# EasyEDA Pro project ProPrj_EEG_2025-12-13.epro

# Schematic fonte
Board Name: Fonte; Create Date: 2025-09-29; Page Name: P1; Project Name: EEG; Schematic Name: fonte; Update Date: 2025-10-28; Company: EasyEDA.com; Page Size: A4; Version: V1.0
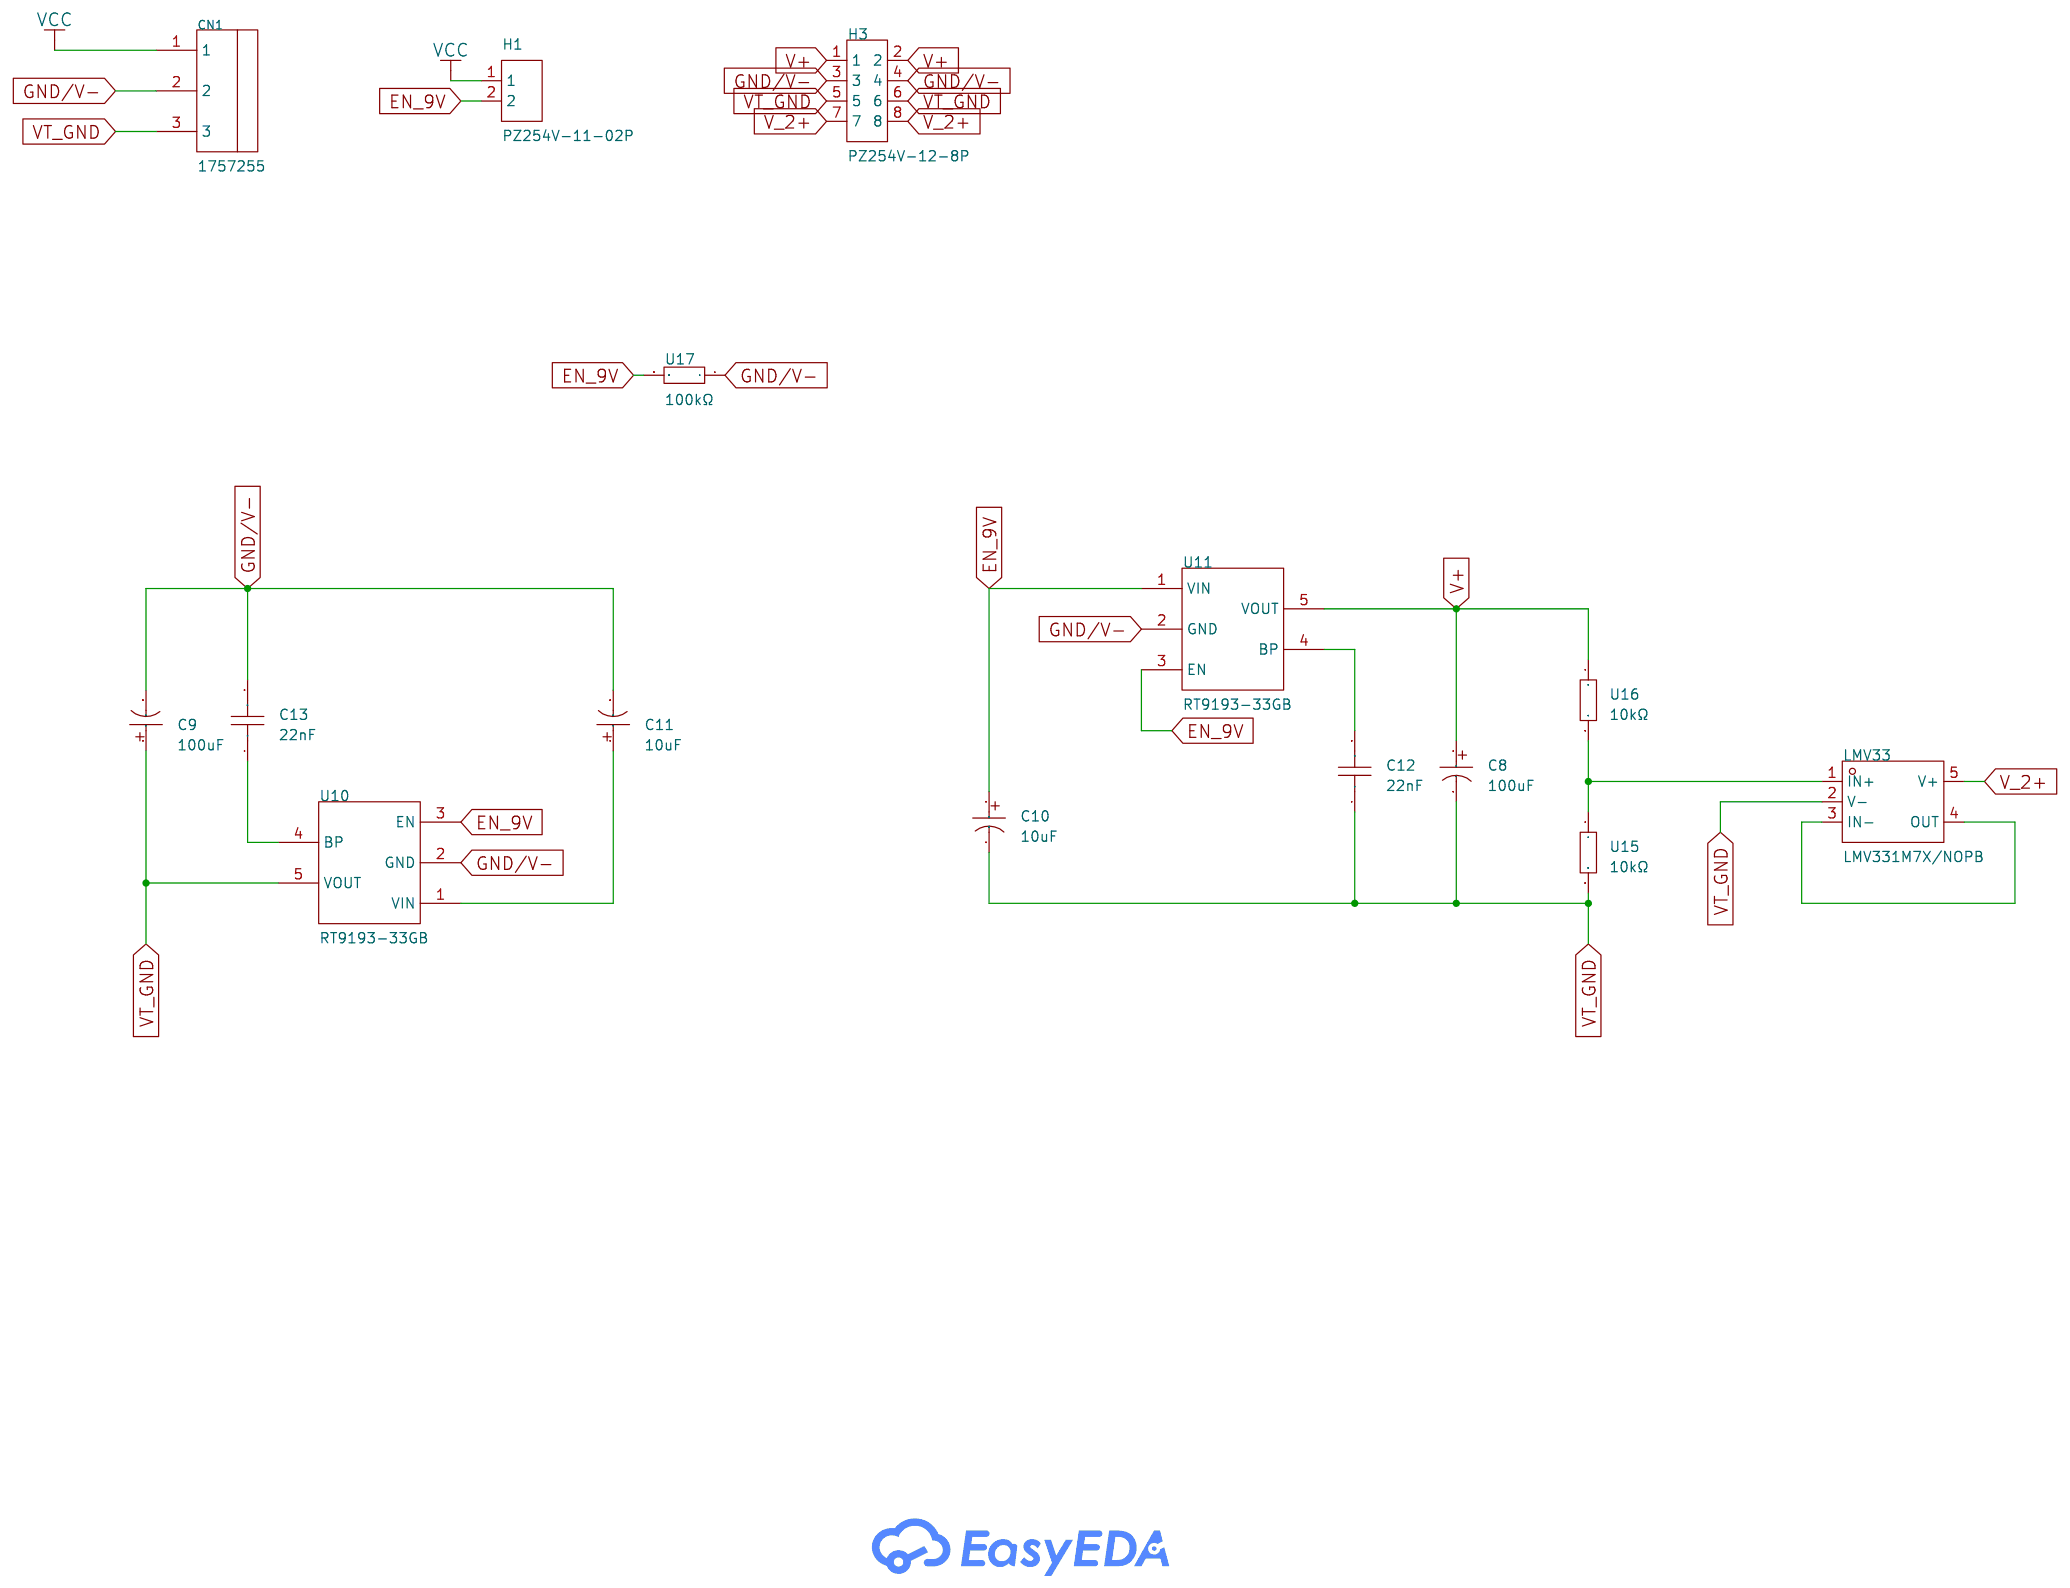
[diagram p0: schematic sheet]

## Parts
C8  100uF  [CAP-TH_BD5.0-P2.00-D0.8-FD]
C9  100uF  [CAP-TH_BD5.0-P2.00-D0.8-FD]
C10  10uF  [CAP-TH_BD5.0-P2.00-D0.8-FD]
C11  10uF  [CAP-TH_BD5.0-P2.00-D0.8-FD]
C12  22nF  [CAP-TH_L4.8-W2.3-P5.08-D0.65]
C13  22nF  [CAP-TH_L4.8-W2.3-P5.08-D0.65]
CN1  1757255  [CONN-TH_3P-P5.08_1757255]
H1  PZ254V-11-02P  [HDR-TH_2P-P2.54-V-M]
H3  PZ254V-12-8P  [HDR-TH_8P-P2.54-V-M-R2-C4-S2.54]
LMV33  LMV331M7X/NOPB  [SC-70-5_L2.1-W1.3-P0.65-LS2.1-BR]
U10  RT9193-33GB  [SOT-23-5_L3.0-W1.7-P0.95-LS2.8-BL]
U11  RT9193-33GB  [SOT-23-5_L3.0-W1.7-P0.95-LS2.8-BL]
U15  10kΩ  [RES-TH_BD2.7-L6.2-P10.20-D0.4]
U16  10kΩ  [RES-TH_BD2.7-L6.2-P10.20-D0.4]
U17  100kΩ  [RES-TH_BD2.7-L6.2-P10.20-D0.4]

## Library data of the parts
C8 C9 = KS107M016D07RR0VH2FP0: Capacitance:100uF Tolerance:±20% Tolerance:±20% Voltage Rating:16V Ripple Current:- Equivalent Series Resistance(ESR):- Pin Spacing:2mm Diameter:5mm Height - Seated (Max):7mm Lifetime:1000hrs@105℃ Operating Temperature:-40℃~+105℃ Operating Temperature:-40; LCSC Part Name: 100uF ±20% 16V; Supplier Part: C43803; Manufacturer: Chengx(承兴); Supplier Footprint: 插件,D5xL7mm; JLCPCB Part Class: Extended Part; Datasheet: https://item.szlcsc.com/datasheet/KS107M016D07RR0VH2FP0/44805.html; Supplier: LCSC; Tolerance: ±20%; Voltage Rating: 16V; Pin Spacing: 2mm; Diameter: 5mm; Height - Seated (Max): 7mm; Lifetime: 1000hrs@105℃; Operating Temperature: -40℃~+105℃
C10 C11 = KM106M016D11RR0VH2FP0: Capacitance:10uF Tolerance:±20% Tolerance:±20% Voltage Rating:16V Ripple Current:35mA@120Hz Equivalent Series Resistance(ESR):- Pin Spacing:2mm Diameter:5mm Height - Seated (Max):11mm Lifetime:1000hrs@105℃; LCSC Part Name: 10uF ±20% 16V; Supplier Part: C43799; Manufacturer: Chengx(承兴); Supplier Footprint: 插件,D5xL11mm; JLCPCB Part Class: Extended Part; Datasheet: https://item.szlcsc.com/datasheet/KM106M016D11RR0VH2FP0/44801.html; Supplier: LCSC; Tolerance: ±20%; Voltage Rating: 16V; Ripple Current: 35mA@120Hz; Pin Spacing: 2mm; Diameter: 5mm; Height - Seated (Max): 11mm; Lifetime: 1000hrs@105℃
C12 C13 = CC1H223ZC1FD3F4D1000: Capacitance:22nF Tolerance:-20%~+80% Tolerance:-20%~+80% Voltage Rating:50V Pin Spacing:5.08mm Temperature Coefficient:Y5V Diameter:4.8mm Body Thickness:2.2mm; LCSC Part Name: 22nF -20%~+80% 50V; Supplier Part: C377845; Manufacturer: Dersonic(德尔创); Supplier Footprint: 插件,P=5.08mm; JLCPCB Part Class: Extended Part; Datasheet: https://item.szlcsc.com/datasheet/CC1H223ZC1FD3F4D1000/350340.html; Supplier: LCSC; Tolerance: -20%~+80%; Voltage Rating: 50V; Pin Spacing: 5.08mm; Temperature Coefficient: Y5V; Diameter: 4.8mm; Body Thickness: 2.2mm
CN1 = 1757255: Connector Type:Board Side/Socket - Closed Number of Positions or Pins:1x3P Pitch:5.08mm Color:Green Mounting Type:Right-Angle Pin Number of Pins:3P Number of Rows:1 Number of PINs Per Row:3; LCSC Part Name: 5.08mm 1x3P 排数:1 每排P数:3; Supplier Part: C92141; Manufacturer: Phoenix Contact(菲尼克斯); Supplier Footprint: 弯插,P=5.08mm; JLCPCB Part Class: Extended Part; Datasheet: https://item.szlcsc.com/datasheet/1757255/93331.html; Supplier: LCSC; Connector Type: Board Side/Socket - Closed; Number of Positions or Pins: 1x3P; Pitch: 5.08mm; Color: Green; Mounting Type: Right-Angle Pin; Number of Pins: 3P; Number of Rows: 1; Number of PINs Per Row: 3
H1 = PZ254V-11-02P: Pin Structure:1x2P Pitch:2.54mm Row Spacing:- Circluar Pins/Square Pins:Pin Header Mounting Type:Through Hole Number of Rows:1 Number of Pins:2P Current Rating:- Voltage Rating (Max):- Length of Mating Pin:6mm Insulation Height:2.5mm Length of End Connect; LCSC Part Name: 1x2P 间距:2.54mm 方针 直插; Supplier Part: C492401; Manufacturer: XFCN(兴飞); Supplier Footprint: 插件,P=2.54mm; JLCPCB Part Class: Extended Part; Datasheet: https://item.szlcsc.com/datasheet/PZ254V-11-02P/502957.html; Supplier: LCSC; Pin Structure: 1x2P; Pitch: 2.54mm; Circluar Pins/Square Pins: Pin Header; Mounting Type: Through Hole; Number of Rows: 1; Number of Pins: 2P; Length of Mating Pin: 6mm; Insulation Height: 2.5mm; Length of End Connection Pin: 3mm; Contact Material: Brass; Operating Temperature: -40℃~+105℃; Color: Black
H3 = PZ254V-12-8P: Pin Structure:2x4P Pitch:2.54mm Row Spacing:2.54mm Circluar Pins/Square Pins:Pin Header Mounting Type:Through Hole Number of Rows:2 Number of Pins:8P Current Rating:- Voltage Rating (Max):- Length of Mating Pin:6mm Insulation Height:2.5mm Length of End Co; LCSC Part Name: 2x4P 间距:2.54mm 方针 直插; Supplier Part: C492421; Manufacturer: XFCN(兴飞); Supplier Footprint: 插件,P=2.54mm; JLCPCB Part Class: Extended Part; Datasheet: https://item.szlcsc.com/datasheet/PZ254V-12-8P/502977.html; Supplier: LCSC; Pin Structure: 2x4P; Pitch: 2.54mm; Row Spacing: 2.54mm; Circluar Pins/Square Pins: Pin Header; Mounting Type: Through Hole; Number of Rows: 2; Number of Pins: 8P; Length of Mating Pin: 6mm; Insulation Height: 2.5mm; Length of End Connection Pin: 3mm; Contact Material: Brass; Operating Temperature: -40℃~+105℃; Color: Black
LMV33 = LMV331M7X/NOPB: Number of Channels:1 Vos - Input Offset Voltage:7mV Ib - Input Bias Current:250nA Propagation Delay Time:600ns Input Hysteresis Voltage (Vhys):- Common Mode Rejection Ratio(CMRR):- Output Type:- Output Type:TTL；CMOS Rail to Rail:Rail-to-Rail Input Quiesce; Supplier Part: C701938; Manufacturer: TI(德州仪器); Supplier Footprint: SC-70-5; JLCPCB Part Class: Extended Part; Datasheet: https://www.ti.com/cn/lit/gpn/lmv393-n; Supplier: LCSC; Number of Channels: 1; Vos - Input Offset Voltage: 7mV; Ib - Input Bias Current: 250nA; Propagation Delay Time: 600ns; Output Type: TTL；CMOS; Rail to Rail: Rail-to-Rail Input; Quiescent Current: 140uA; Operating Temperature: -40℃~+85℃
U10 U11 = RT9193-33GB: Output Type:Fixed Voltage - Supply:5.5V Output Voltage:3.3V Output Voltage:3.3V Output Current:300mA Power Supply Rejection Ratio (PSRR):-50dB@(10kHz) Voltage Dropout:220mV@(300mA) standby current:90uA Noise:100uVrms Features:Over Current Protection；Enabl; LCSC Part Name: 输入5.5V 输出3.3V 300mA; Supplier Part: C15651; Manufacturer: RICHTEK(立锜); Supplier Footprint: SOT-23-5; JLCPCB Part Class: Extended Part; Datasheet: https://item.szlcsc.com/datasheet/RT9193-33GB/16332.html; Supplier: LCSC; Output Type: Fixed; Voltage - Supply: 5.5V; Output Voltage: 3.3V; Output Current: 300mA; Power Supply Rejection Ratio (PSRR): -50dB@(10kHz); Voltage Dropout: 220mV@(300mA); standby current: 90uA; Noise: 100uVrms; Features: Over Current Protection；Enable；Over Temperature Protection; Operating Temperature: -40℃~+125℃@(Tj); Output Configuration: Positive; Number of Outputs: 1
U15-U17 = MF1/4W-100K±1%-OT26: Type:Metal Film Resistors Resistance: Tolerance:±1% Tolerance:±1% Overload Voltage (Max):250V Power(Watts):250mW Temperature Coefficient:±350ppm/℃ Temperature Coefficient:±350ppm/℃ Operating Temperature Range:-55℃~+155℃ Operating Temperature Range:-55℃~+1; LCSC Part Name: 金属膜电阻 100kΩ ±1% 250mW; Supplier Part: C2843019; Manufacturer: VO(翔胜); Supplier Footprint: 插件,D2.7xL6.2mm; JLCPCB Part Class: Extended Part; Datasheet: https://atta.szlcsc.com/upload/public/pdf/source/20200609/C601728_5AA4C0C8E12E11069DA2C3356F29D1F2.pdf; Supplier: LCSC; Type: Metal Film Resistors; Tolerance: ±1%; Overload Voltage (Max): 250V; Power(Watts): 250mW; Temperature Coefficient: ±350ppm/℃; Operating Temperature Range: -55℃~+155℃

## Nets
VCC: CN1.1 H1.1
EN_9V: C10.1 H1.2 U10.3(EN) U11.1(VIN) U11.3(EN) U17.2
GND/V-: C9.2 C11.2 C13.2 CN1.2 H3.3 H3.4 U10.2(GND) U11.2(GND) U17.1
V+: C8.1 H3.1 H3.2 U11.5(VOUT) U16.1
V_2+: H3.7 H3.8 LMV33.5(V+)
VT_GND: C8.2 C9.1 C10.2 C12.1 CN1.3 H3.5 H3.6 LMV33.2(V-) U10.5(VOUT) U15.2
$1N1779: LMV33.3(IN-) LMV33.4(OUT)
Net-(C11-1): C11.1 U10.1(VIN)
Net-(C12-2): C12.2 U11.4(BP)
Net-(C13-1): C13.1 U10.4(BP)
Net-(LMV33-1): LMV33.1(IN+) U15.1 U16.2

# Schematic canal
Board Name: Canal; Create Date: 2025-09-29; Page Name: P1; Project Name: EEG; Schematic Name: canal; Update Date: 2025-11-23; Company: EasyEDA.com; Page Size: A4; Version: V1.0
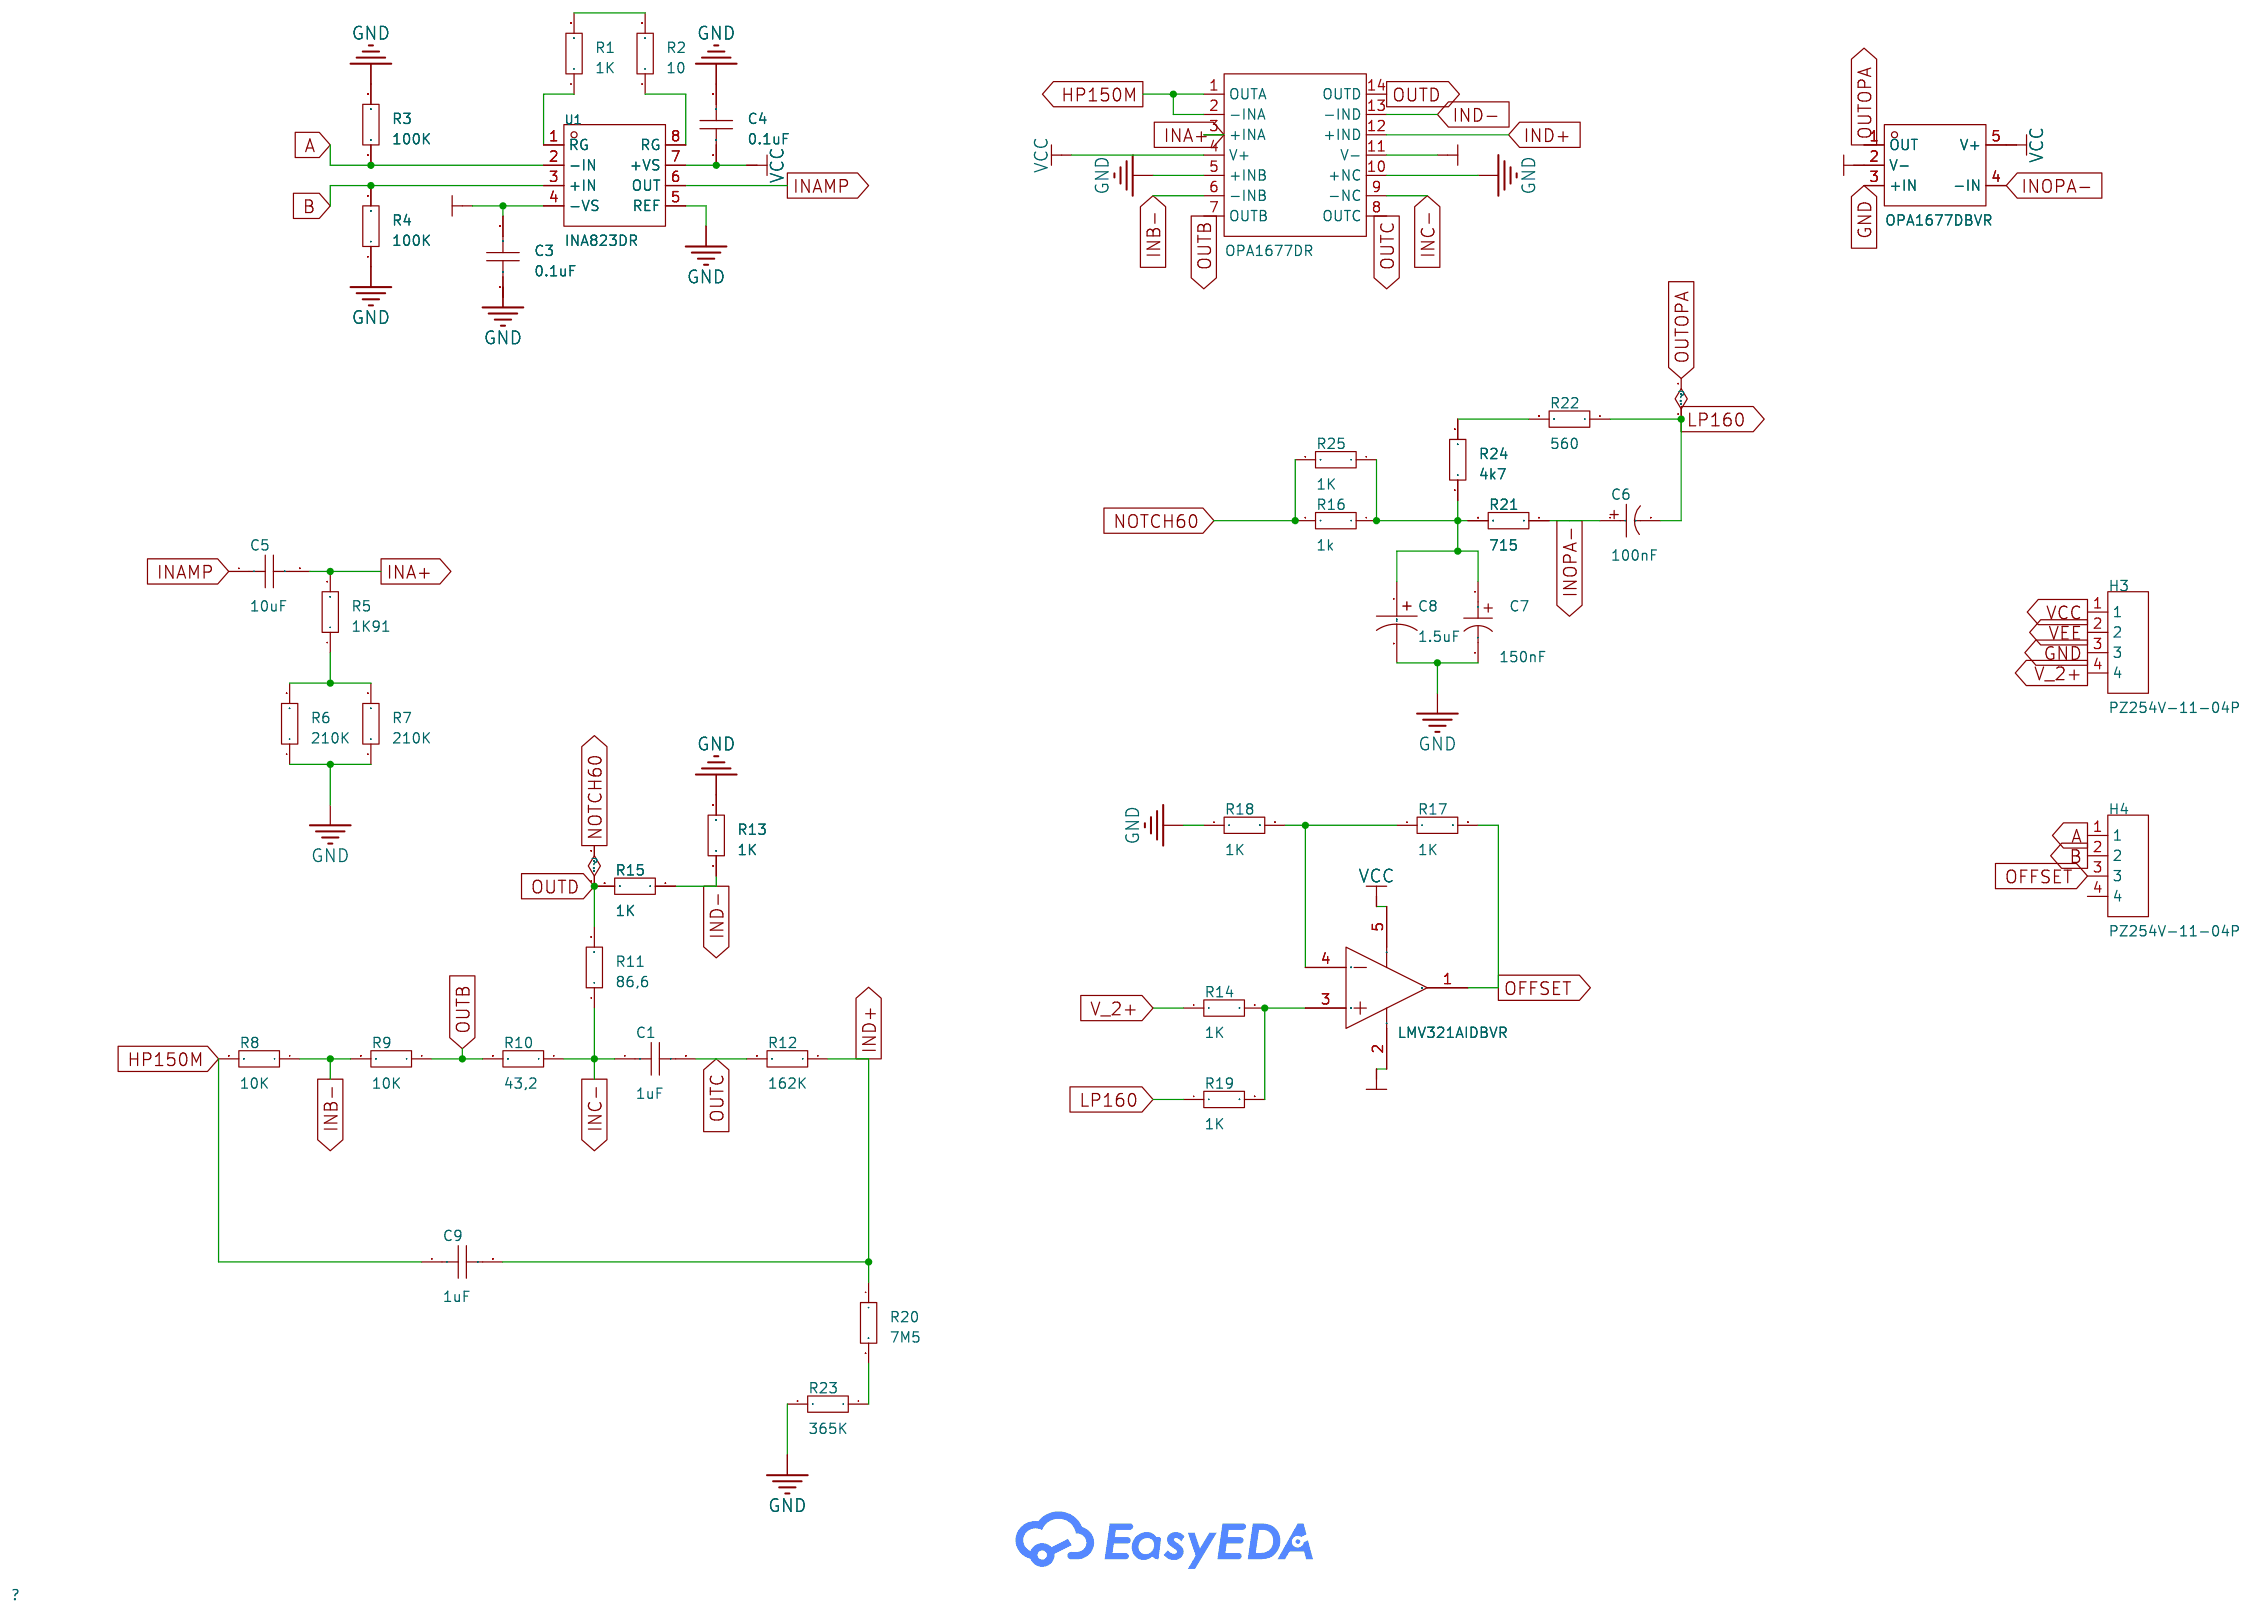
[diagram p1: schematic sheet]

## Parts
C1  1uF  [CAP-TH_L7.5-W5.0-P5.00-D1.0]
C3  0.1uF  [CAP-TH_L7.5-W5.0-P5.00-D1.0]
C4  0.1uF  [CAP-TH_L7.5-W5.0-P5.00-D1.0]
C5  10uF  [CAP-TH_L5.0-W2.5-P2.50-D0.5]
C6  100nF  [CAP-TH_BD4.0-P1.50-D0.8-FD]
C7  150nF  [CAP-TH_BD4.0-P1.50-D0.5-FD]
C8  1.5uF  [CAP-TH_BD8.0-P3.50-D0.6-FD]
C9  1uF  [CAP-TH_L7.5-W5.0-P5.00-D1.0]
H3  PZ254V-11-04P  [HDR-TH_4P-P2.54-V-M]
H4  PZ254V-11-04P  [HDR-TH_4P-P2.54-V-M]
R1  1K  [RES-TH_BD3.8-L8.5-P15.00-D0.6]
R2  10  [RES-TH_BD3.8-L8.5-P15.00-D0.6]
R3  100K  [RES-TH_BD3.8-L8.5-P15.00-D0.6]
R4  100K  [RES-TH_BD3.8-L8.5-P15.00-D0.6]
R5  1K91  [RES-TH_BD3.8-L8.5-P15.00-D0.6]
R6  210K  [RES-TH_BD3.8-L8.5-P15.00-D0.6]
R7  210K  [RES-TH_BD3.8-L8.5-P15.00-D0.6]
R8  10K  [RES-TH_BD3.8-L8.5-P15.00-D0.6]
R9  10K  [RES-TH_BD3.8-L8.5-P15.00-D0.6]
R10  43,2  [RES-TH_BD3.8-L8.5-P15.00-D0.6]
R11  86,6  [RES-TH_BD3.8-L8.5-P15.00-D0.6]
R12  162K  [RES-TH_BD3.8-L8.5-P15.00-D0.6]
R13  1K  [RES-TH_BD3.8-L8.5-P15.00-D0.6]
R14  1K  [RES-TH_BD3.8-L8.5-P15.00-D0.6]
R15  1K  [RES-TH_BD3.8-L8.5-P15.00-D0.6]
R16  1k  [RES-TH_BD3.8-L8.5-P15.00-D0.6]
R17  1K  [RES-TH_BD3.8-L8.5-P15.00-D0.6]
R18  1K  [RES-TH_BD3.8-L8.5-P15.00-D0.6]
R19  1K  [RES-TH_BD3.8-L8.5-P15.00-D0.6]
R20  7M5  [RES-TH_BD3.8-L8.5-P15.00-D0.6]
R21  715  [RES-TH_BD3.8-L8.5-P15.00-D0.6]
R22  560  [RES-TH_BD3.8-L8.5-P15.00-D0.6]
R23  365K  [RES-TH_BD3.8-L8.5-P15.00-D0.6]
R24  4k7  [RES-TH_BD3.8-L8.5-P15.00-D0.6]
R25  1K  [RES-TH_BD3.8-L8.5-P15.00-D0.6]
U1  INA823DR  [SOIC-8_L4.9-W3.9-P1.27-LS6.0-BL]
U2  OPA1677DR  [SOIC-14_L8.7-W3.9-P1.27-LS6.0-BL]
U3  OPA1677DBVR  [SOT-23-5_L2.9-W1.6-P0.95-LS2.8-BR]
U4  LMV321AIDBVR  [SOT-23-5_L2.9-W1.6-P0.95-LS2.8-TL]

## Library data of the parts
C1 C3 C4 C9 = CC45SL3DD101JYVNA: Capacitance:100pF Tolerance:±5% Tolerance:±5% Voltage Rating:2kV Pin Spacing:5mm Temperature Coefficient:SL Diameter:7.5mm Body Thickness:5mm; LCSC Part Name: 100pF ±5% 2kV; Supplier Part: C342459; Manufacturer: TDK; Supplier Footprint: 插件,P=5mm; JLCPCB Part Class: Extended Part; Datasheet: https://item.szlcsc.com/datasheet/CC45SL3DD101JYVNA/319309.html; Supplier: LCSC; Tolerance: ±5%; Voltage Rating: 2kV; Pin Spacing: 5mm; Temperature Coefficient: SL; Diameter: 7.5mm; Body Thickness: 5mm
C5 = CC1H103ZA1ED3F4D1100: Capacitance:10nF Tolerance:-20%~+80% Tolerance:-20%~+80% Voltage Rating:50V Pin Spacing:2.54mm Temperature Coefficient:Y5V Diameter:5mm Body Thickness:2.4mm; LCSC Part Name: 10nF -20%~+80% 50V; Supplier Part: C2832505; Manufacturer: Dersonic(德尔创); Supplier Footprint: 插件,P=2.54mm; JLCPCB Part Class: Extended Part; Datasheet: https://item.szlcsc.com/datasheet/CC1H103ZA1ED3F4D1100/2990643.html; Supplier: LCSC; Tolerance: -20%~+80%; Voltage Rating: 50V; Pin Spacing: 2.54mm; Temperature Coefficient: Y5V; Diameter: 5mm; Body Thickness: 2.4mm
C6 = KS104M050C07RR0VH2FP0: Capacitance:100nF Tolerance:±20% Tolerance:±20% Voltage Rating:50V Ripple Current:1A@100kHz Equivalent Series Resistance(ESR):- Pin Spacing:1.5mm Diameter:4mm Height - Seated (Max):7mm Lifetime:1000hrs@105℃ Operating Temperature:-40℃~+105℃ Operating Tempe; LCSC Part Name: 100nF ±20% 50V; Supplier Part: C45664; Manufacturer: Chengx(承兴); Supplier Footprint: 插件,D4xL7mm; JLCPCB Part Class: Extended Part; Datasheet: https://item.szlcsc.com/datasheet/KS104M050C07RR0VH2FP0/46666.html; Supplier: LCSC; Tolerance: ±20%; Voltage Rating: 50V; Ripple Current: 1A@100kHz; Pin Spacing: 1.5mm; Diameter: 4mm; Height - Seated (Max): 7mm; Lifetime: 1000hrs@105℃; Operating Temperature: -40℃~+105℃
C7 = EEA-GA1HR15: Capacitance:150nF Tolerance:±20% Tolerance:±20% Rated Voltage: Ripple Current:1.7mA@120Hz Equivalent Series Resistance(ESR):- Lead Spacing: φD: L: Lifetime @ Temp:1000hrs@105℃ Operating Temperature:-55℃~+105℃ Operating Temperature:-55℃~+105℃; LCSC Part Name: 150nF ±20% 50V; Supplier Part: C5114215; Manufacturer: PANASONIC(松下); Supplier Footprint: 插件,D4xL7mm; JLCPCB Part Class: Extended Part; Datasheet: https://atta.szlcsc.com/upload/public/pdf/source/20231023/GA_Series_Type_A.pdf-271ac9210b5e00e392f99268b7a37256.pdf; Supplier: LCSC; Tolerance: ±20%; Ripple Current: 1.7mA@120Hz; Lifetime @ Temp: 1000hrs@105℃; Operating Temperature: -55℃~+105℃
C8 = ECG2GM1R5F12OTBO: Capacitance:1.5uF Tolerance:±20% Tolerance:±20% Voltage Rating:400V Ripple Current:73mA@100kHz Equivalent Series Resistance(ESR):- Pin Spacing:3.5mm Diameter:8mm Height - Seated (Max):12mm Lifetime:8000hrs@105℃; LCSC Part Name: 1.5uF ±20% 400V; Supplier Part: C711612; Manufacturer: Yunxing(云星); Supplier Footprint: 插件,D8xL12mm; JLCPCB Part Class: Extended Part; Datasheet: https://item.szlcsc.com/datasheet/ECG2GM1R5F12OTBO/750717.html; Supplier: LCSC; Tolerance: ±20%; Voltage Rating: 400V; Ripple Current: 73mA@100kHz; Pin Spacing: 3.5mm; Diameter: 8mm; Height - Seated (Max): 12mm; Lifetime: 8000hrs@105℃
H3 H4 = PZ254V-11-04P_C492403: Pin Structure:1x4P Pitch:2.54mm Row Spacing:- Circluar Pins/Square Pins:Policy Mounting Type:Straight Number of Rows:Single Row Number of Pins:4P Current Rating:- Voltage Rating (Max):- Length of Mating Pin:6mm Insulation Height:2.5mm Length of End Connec; LCSC Part Name: 1x4P 间距:2.54mm 方针 直插; Supplier Part: C492403; Manufacturer: XFCN(兴飞); Supplier Footprint: 插件,P=2.54mm; JLCPCB Part Class: Extended Part; Datasheet: https://atta.szlcsc.com/upload/public/pdf/source/20200309/C492403_F9F19131791D08044AD4F84F8E751A34.pdf; Supplier: LCSC; Pin Structure: 1x4P; Pitch: 2.54mm; Circluar Pins/Square Pins: Policy; Mounting Type: Straight; Number of Rows: Single Row; Number of Pins: 4P; Length of Mating Pin: 6mm; Insulation Height: 2.5mm; Length of End Connection Pin: 3mm; Contact Material: Brass; Operating Temperature: -40℃~+105℃; Color: Black
R1-R25 = Res_0603: Supplier Footprint: 0603
U1 = INA823DR: Number of Channels:1 Ib - Input Bias Current:1.2pA Vos - Input Offset Voltage:20uV Gain Bandwidth Product:- Slew Rate:1V/us Operating Temperature:-40℃~+125℃ Operating Temperature:-40℃~+125℃; LCSC Part Name: 精密(100uV)、低功耗(250uA)、宽电源(2.7V 至 36V）仪表放大器; Supplier Part: C5213939; Manufacturer: TI(德州仪器); Supplier Footprint: SOIC-8; JLCPCB Part Class: Extended Part; Datasheet: https://www.ti.com/cn/lit/gpn/ina823; Supplier: LCSC; Number of Channels: 1; Ib - Input Bias Current: 1.2pA; Vos - Input Offset Voltage: 20uV; Slew Rate: 1V/us; Operating Temperature: -40℃~+125℃
U2 = OPA1677DR: Supplier Part: C22444684; Manufacturer: TI(德州仪器); Supplier Footprint: SOIC-8; JLCPCB Part Class: Extended Part; Datasheet: https://www.ti.com.cn/cn/lit/ds/symlink/opa1677.pdf; Supplier: LCSC
U3 = OPA1677DBVR: Voltage - Supply:2.25V~18V；-18V~-2.25V Voltage - Supply:2.25V~18V；-18V~-2.25V Total Harmonic Distortion + Noise (THD+N):0.0001% Quiescent Current:2mA Operating Temperature:-40℃~+85℃ Operating Temperature:-40℃~+85℃; LCSC Part Name: OPA167x低失真音频运算放大器; Supplier Part: C3445866; Manufacturer: TI(德州仪器); Supplier Footprint: SOT-23-5; JLCPCB Part Class: Extended Part; Datasheet: https://www.ti.com/cn/lit/gpn/opa1679; Supplier: LCSC; Voltage - Supply: 2.25V~18V；-18V~-2.25V; Total Harmonic Distortion + Noise (THD+N): 0.0001%; Quiescent Current: 2mA; Operating Temperature: -40℃~+85℃
U4 = LMV321AIDBVR: Number of Channels:1 Maximum Power Supply Range (Vdd-Vss):9V Rail to Rail:- Gain Bandwidth Product:- Vos - Input Offset Voltage:4mV Input Offset Voltage Drift(Vos TC):1uV/℃ Slew Rate:1.7V/us Ib - Input Bias Current:10pA Input Offset Current(Ios):- Noise d; LCSC Part Name: LMV3xxA 低压轨到轨输出运算放大器; Supplier Part: C484730; Manufacturer: TI(德州仪器); Supplier Footprint: SOT-23-5; JLCPCB Part Class: Extended Part; Datasheet: https://www.ti.com/cn/lit/gpn/lmv358a; Supplier: LCSC; Number of Channels: 1; Maximum Power Supply Range (Vdd-Vss): 9V; Vos - Input Offset Voltage: 4mV; Input Offset Voltage Drift(Vos TC): 1uV/℃; Slew Rate: 1.7V/us; Ib - Input Bias Current: 10pA; Noise density(eN): 30nV/√Hz@1kHz; Common Mode Rejection Ratio(CMRR): 100dB; Operating Temperature: -40℃~+125℃; Single supply: 2.5V~5.5V

## Nets
GND: C3.1 C4.2 C7.2 C8.2 H3.3 R3.2 R4.1 R6.1 R7.1 R13.2 R18.1 R23.2 U1.5(REF) U2.5(+INB) U2.10(+NC) U3.3(+IN)
VCC: C4.1 H3.1 U1.7(+VS) U2.4(V+) U3.5(V+) U4.5(V+)
VEE: C3.2 H3.2 U1.4(-VS) U2.11(V-) U3.2(V-) U4.2(V-)
A: H4.1 R3.1 U1.2(-IN)
B: H4.2 R4.2 U1.3(+IN)
HP150M: C9.1 R8.2 U2.1(OUTA) U2.2(-INA)
INA+: C5.2 R5.2 U2.3(+INA)
INAMP: C5.1 U1.6(OUT)
INB-: R8.1 R9.2 U2.6(-INB)
INC-: C1.1 R10.1 R11.1 U2.9(-NC)
IND+: C9.2 R12.1 R20.1 U2.12(+IND)
IND-: R13.1 R15.1 U2.13(-IND)
INOPA-: C6.1 R21.1 U3.4(-IN)
LP160: C6.2 R19.1 R22.1 U3.1(OUT)
NOTCH60: R11.2 R15.2 R16.2 R25.2 U2.14(OUTD)
OFFSET: H4.3 R17.2 U4.1(OUT)
OUTB: R9.1 R10.2 U2.7(OUTB)
OUTC: C1.2 R12.2 U2.8(OUTC)
V_2+: H3.4 R14.1
$1N2958: C7.1 C8.1 R16.1 R21.2 R24.1 R25.1
$1N3420: R17.1 R18.2 U4.4(IN-)
$1N3441: R14.2 R19.2 U4.3(IN+)
$1N10128: R1.1 U1.1(RG)
$1N10133: R1.2 R2.2
$1N10138: R2.1 U1.8(RG)
$1N10195: R5.1 R6.2 R7.2
$1N10257: R20.2 R23.1
$1N10286: R22.2 R24.2

Not connected (* = marked no-connect by the designer): H4 4

# Board PCB2
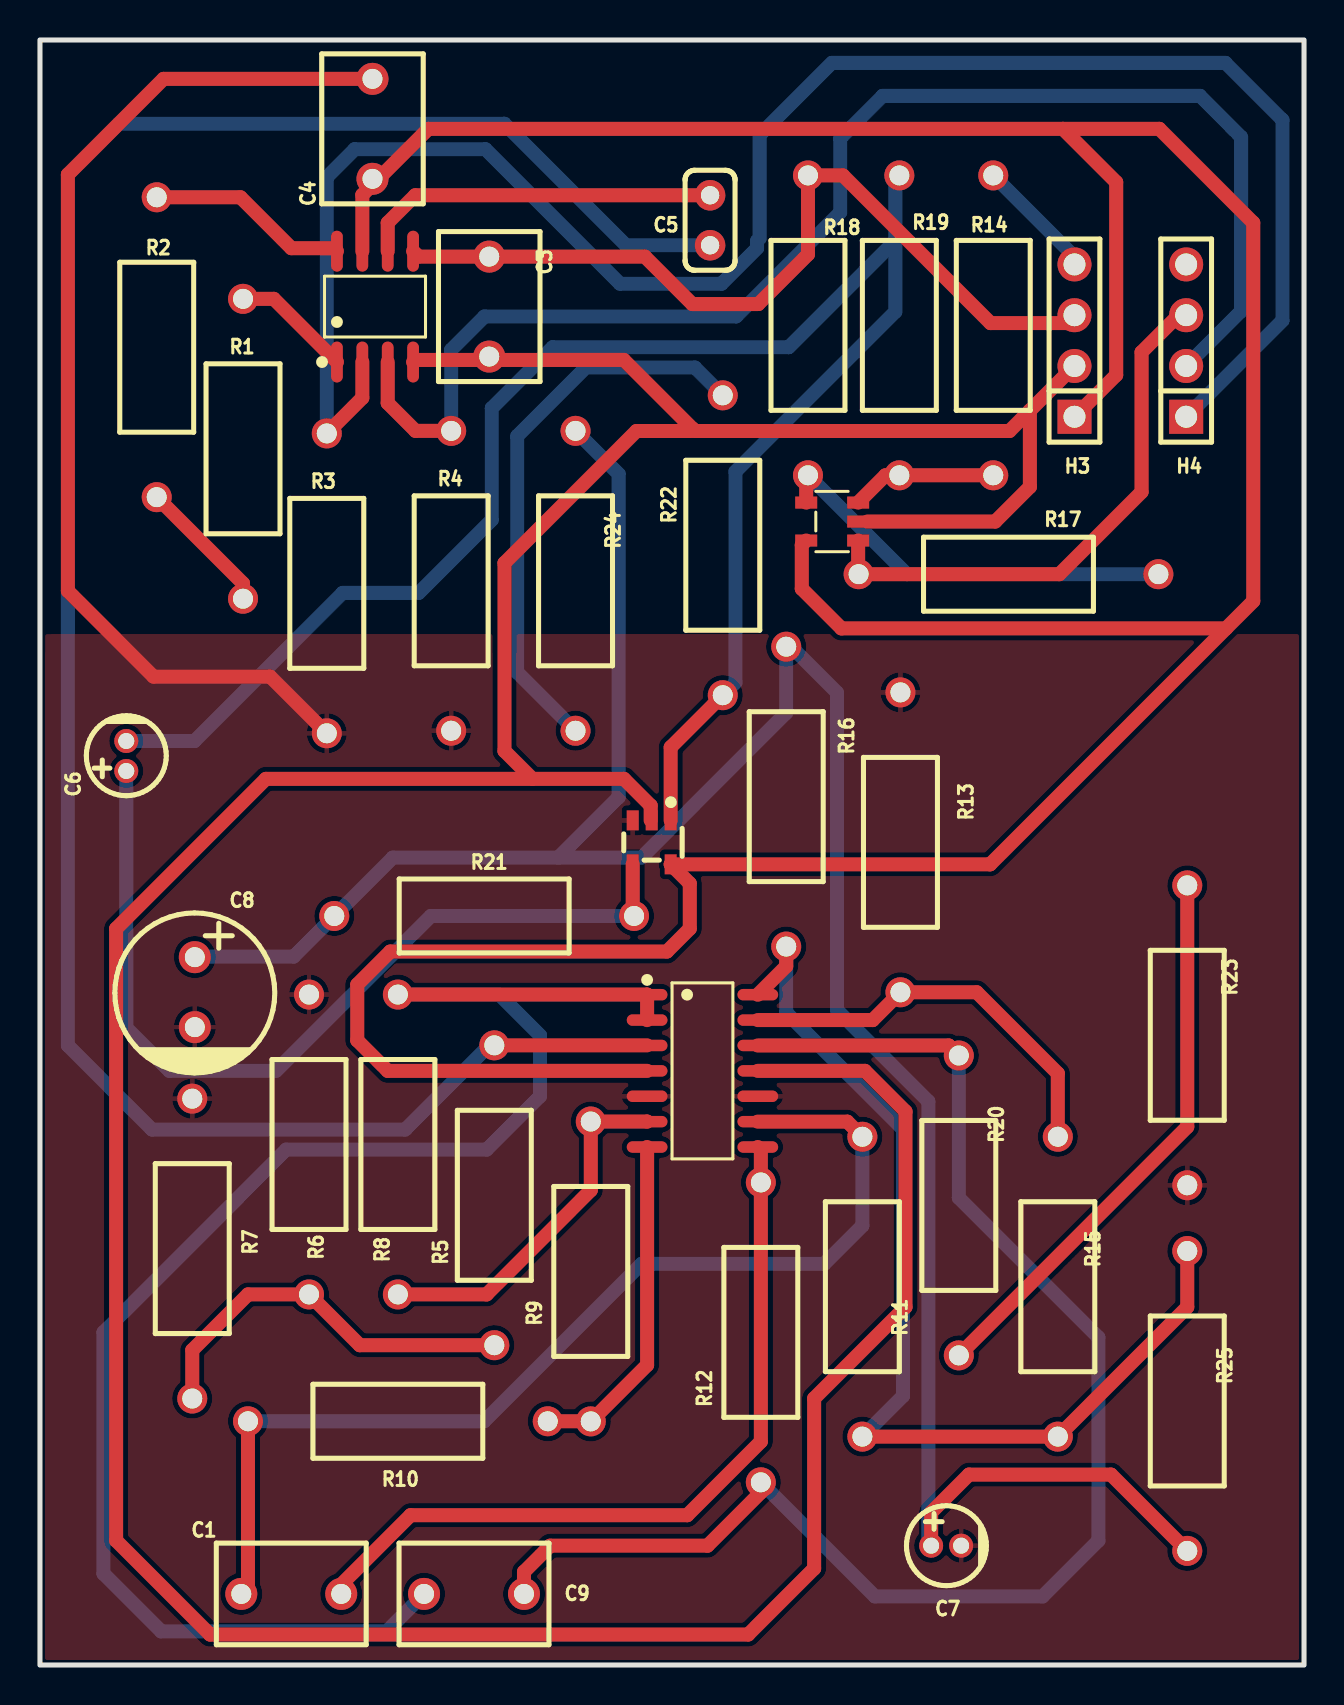
[diagram p2: board, top side]
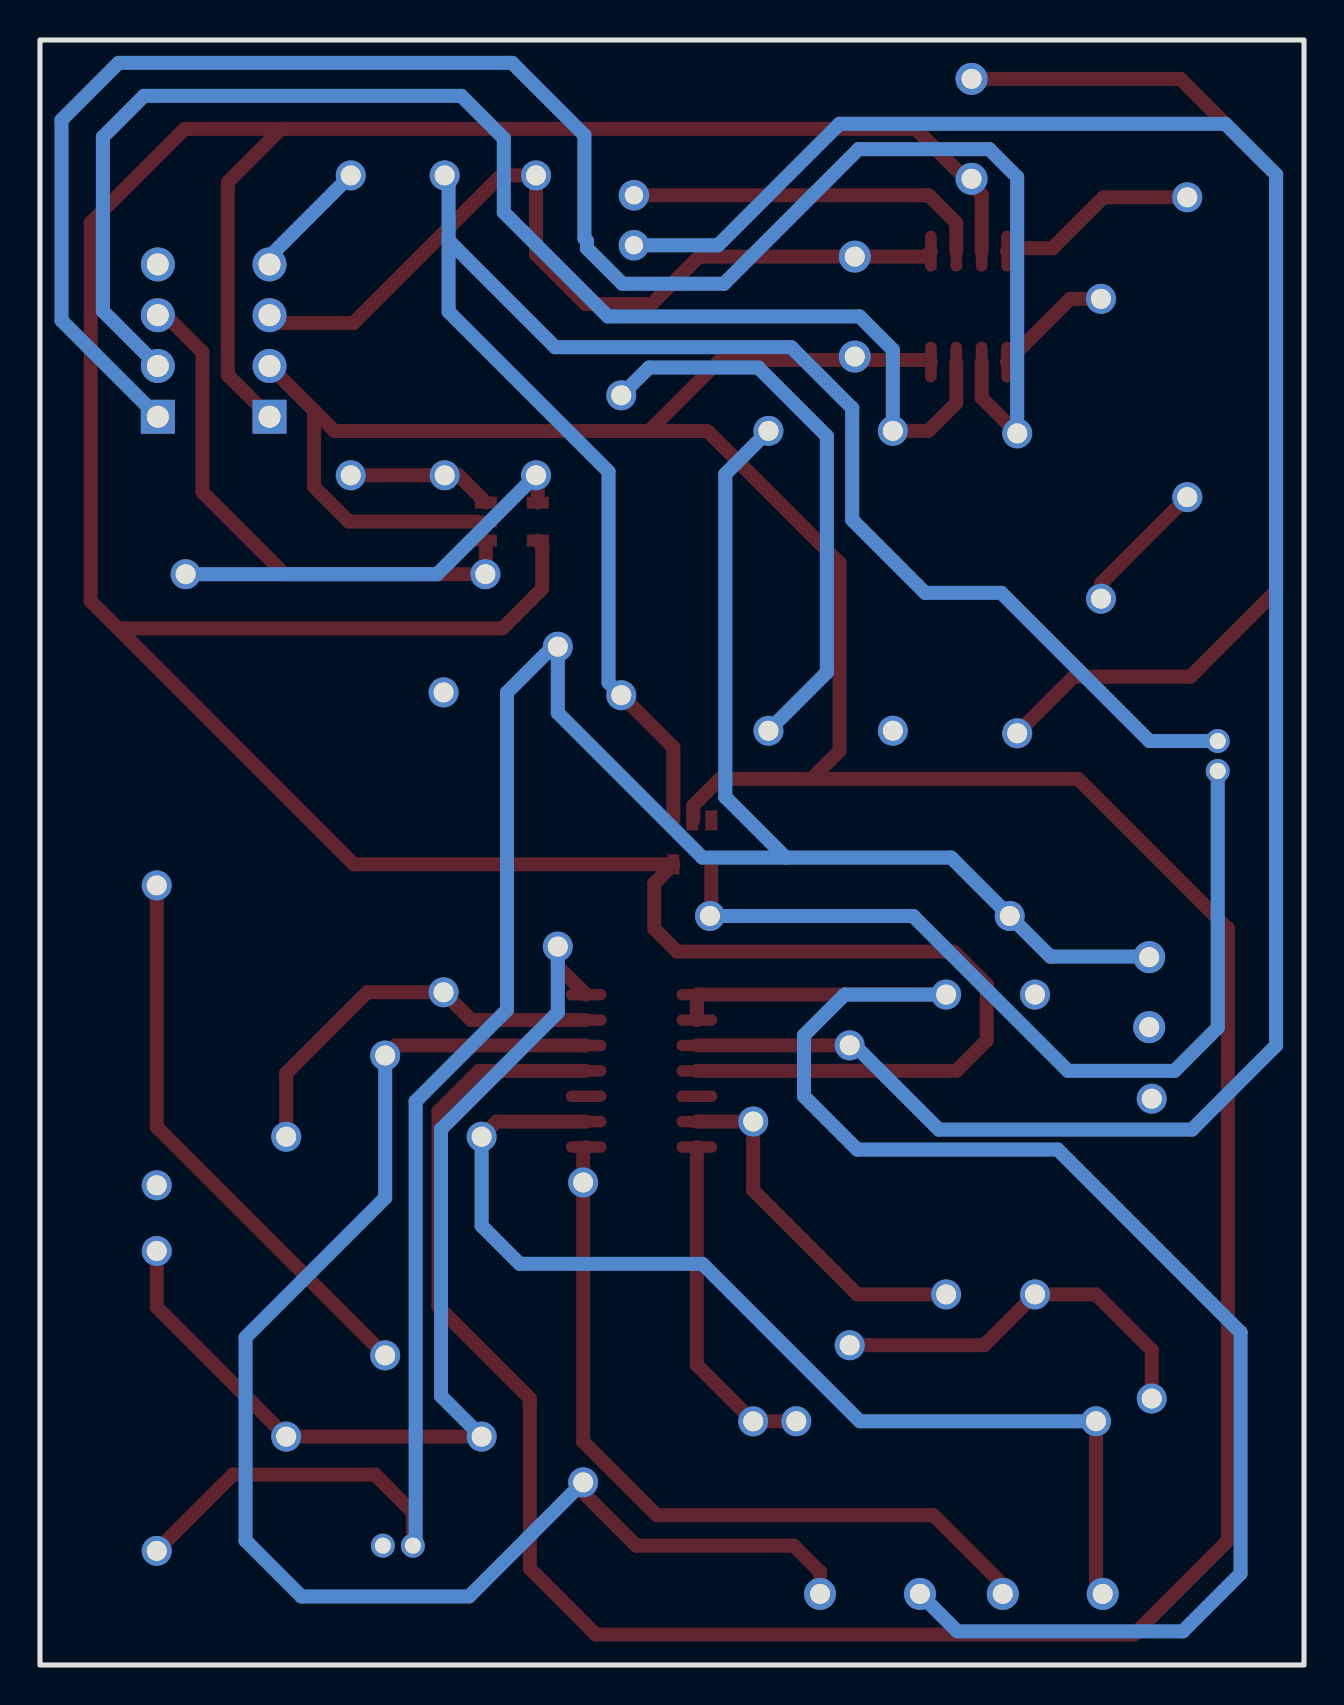
[diagram p3: board, bottom side, seen from below]

Outline 63.25 x 81.28 mm; copper layers: Top Layer, Bottom Layer. Coordinates in mm from the lower left corner of the outline.
Outline path: rectangle 0,81.28 63.25,0
Stack: Top Layer 0.035mm / Dielectric1 1.51mm FR4 er 4.5 / Bottom Layer 0.035mm

## Design rules (mm)
template: Custom Config
spacing copperThickness1oz (default): track to track 0.3, other pairs 0.152 to 0.3
spacing copperThickness2oz: track to track 0.203, other pairs 0.152 to 0.3
track width copperThickness1oz (default): min 0.127, default 0.7, max 2.54
track width copperThickness2oz: min 0.203, default 0.254, max 2.54
differential pair differentialPair (default): width min 0.127, default 0.254, max 2.54; gap min 0.152, default 0.152
via viaSize (default): diameter min 0.5, default 0.61, max 10; hole min 0.3, default 0.305, max 6.3

## Placement (name value [footprint] x y rotation side)
C1  1uF  [CAP-TH_L7.5-W5.0-P5.00-D1.0]  12.57 3.56 0 top
C3  0.1uF  [CAP-TH_L7.5-W5.0-P5.00-D1.0]  22.48 67.95 270 top
C4  0.1uF  [CAP-TH_L7.5-W5.0-P5.00-D1.0]  16.64 76.84 90 top
C5  10uF  [CAP-TH_L5.0-W2.5-P2.50-D0.5]  33.53 72.26 270 top
C6  100nF  [CAP-TH_BD4.0-P1.50-D0.8-FD]  4.32 45.47 90 top
C7  150nF  [CAP-TH_BD4.0-P1.50-D0.5-FD]  45.34 5.97 0 top
C8  1.5uF  [CAP-TH_BD8.0-P3.50-D0.6-FD]  7.75 33.66 270 top
C9  1uF  [CAP-TH_L7.5-W5.0-P5.00-D1.0]  21.72 3.56 0 top
H3  PZ254V-11-04P  [HDR-TH_4P-P2.54-V-M]  51.76 66.24 90 top
H4  PZ254V-11-04P  [HDR-TH_4P-P2.54-V-M]  57.35 66.24 90 top
R1  1K  [RES-TH_BD3.8-L8.5-P15.00-D0.6]  10.16 60.83 270 top
R2  10  [RES-TH_BD3.8-L8.5-P15.00-D0.6]  5.84 65.91 270 top
R3  100K  [RES-TH_BD3.8-L8.5-P15.00-D0.6]  14.35 54.1 270 top
R4  100K  [RES-TH_BD3.8-L8.5-P15.00-D0.6]  20.57 54.23 90 top
R5  1K91  [RES-TH_BD3.8-L8.5-P15.00-D0.6]  22.73 23.5 90 top
R6  210K  [RES-TH_BD3.8-L8.5-P15.00-D0.6]  13.46 26.03 270 top
R7  210K  [RES-TH_BD3.8-L8.5-P15.00-D0.6]  7.62 20.83 270 top
R8  10K  [RES-TH_BD3.8-L8.5-P15.00-D0.6]  17.91 26.03 90 top
R9  10K  [RES-TH_BD3.8-L8.5-P15.00-D0.6]  27.56 19.69 90 top
R10  43,2  [RES-TH_BD3.8-L8.5-P15.00-D0.6]  17.91 12.19 0 top
R11  86,6  [RES-TH_BD3.8-L8.5-P15.00-D0.6]  41.15 18.92 270 top
R12  162K  [RES-TH_BD3.8-L8.5-P15.00-D0.6]  36.07 16.64 90 top
R13  1K  [RES-TH_BD3.8-L8.5-P15.00-D0.6]  43.05 41.15 90 top
R14  1K  [RES-TH_BD3.8-L8.5-P15.00-D0.6]  47.7 67.01 270 top
R15  1K  [RES-TH_BD3.8-L8.5-P15.00-D0.6]  50.93 18.92 270 top
R16  1k  [RES-TH_BD3.8-L8.5-P15.00-D0.6]  37.34 43.43 270 top
R17  1K  [RES-TH_BD3.8-L8.5-P15.00-D0.6]  48.46 54.56 180 top
R18  1K  [RES-TH_BD3.8-L8.5-P15.00-D0.6]  38.43 67.01 270 top
R19  1K  [RES-TH_BD3.8-L8.5-P15.00-D0.6]  43 67.01 270 top
R20  7M5  [RES-TH_BD3.8-L8.5-P15.00-D0.6]  45.97 22.99 270 top
R21  715  [RES-TH_BD3.8-L8.5-P15.00-D0.6]  22.23 37.47 180 top
R22  560  [RES-TH_BD3.8-L8.5-P15.00-D0.6]  34.16 56.01 90 top
R23  365K  [RES-TH_BD3.8-L8.5-P15.00-D0.6]  57.4 31.5 270 top
R24  4k7  [RES-TH_BD3.8-L8.5-P15.00-D0.6]  26.8 54.23 270 top
R25  1K  [RES-TH_BD3.8-L8.5-P15.00-D0.6]  57.4 13.21 90 top
U1  INA823DR  [SOIC-8_L4.9-W3.9-P1.27-LS6.0-BL]  16.76 67.95 0 top
U2  OPA1677DR  [SOIC-14_L8.7-W3.9-P1.27-LS6.0-BL]  33.15 29.72 270 top
U3  OPA1677DBVR  [SOT-23-5_L2.9-W1.6-P0.95-LS2.8-BR]  30.61 41.15 90 top
U4  LMV321AIDBVR  [SOT-23-5_L2.9-W1.6-P0.95-LS2.8-TL]  39.64 57.19 180 top

## Footprints (pads in the part's own frame, mm; a bottom-side part is the same pattern mirrored in y, then rotated)
CAP-TH_BD4.0-P1.50-D0.5-FD
  round 1.2 hole 0.8: 1(-0.75,0) 2(0.75,0)
CAP-TH_BD4.0-P1.50-D0.8-FD
  round 1.2 hole 0.8: 1(-0.75,0) 2(0.75,0)
CAP-TH_BD8.0-P3.50-D0.6-FD
  round 1.6 hole 1: 1(-1.75,0) 2(1.75,0)
CAP-TH_L5.0-W2.5-P2.50-D0.5
  round 1.524 hole 0.914: 1(-1.25,0) 2(1.25,0)
CAP-TH_L7.5-W5.0-P5.00-D1.0
  round 1.6 hole 1: 1(-2.5,0) 2(2.5,0)
HDR-TH_4P-P2.54-V-M
  rect 1.7x1.7 hole 1.1: 1(-3.81,0)
  round 1.7 hole 1.1: 2(-1.27,0) 3(1.27,0) 4(3.81,0)
RES-TH_BD3.8-L8.5-P15.00-D0.6
  round 1.5 hole 1: 1(-7.5,0) 2(7.5,0)
SOIC-8_L4.9-W3.9-P1.27-LS6.0-BL
  oval 0.588x2.045 smd: 1(-1.905,-2.772) 2(-0.635,-2.772) 3(0.635,-2.772) 4(1.905,-2.772) 5(1.905,2.772) 6(0.635,2.772) 7(-0.635,2.772) 8(-1.905,2.772)
SOIC-14_L8.7-W3.9-P1.27-LS6.0-BL
  oval 0.574x2.038 smd: 1(-3.81,-2.769) 2(-2.54,-2.769) 3(-1.27,-2.769) 4(0,-2.769) 5(1.27,-2.769) 6(2.54,-2.769) 7(3.81,-2.769) 8(3.81,2.769) 9(2.54,2.769) 10(1.27,2.769) 11(0,2.769) 12(-1.27,2.769) 13(-2.54,2.769) 14(-3.81,2.769)
SOT-23-5_L2.9-W1.6-P0.95-LS2.8-BR
  rect 1x0.6 smd: 1(1.1,-0.95) 2(1.1,0) 3(1.1,0.95) 4(-1.1,0.95) 5(-1.1,-0.95)
SOT-23-5_L2.9-W1.6-P0.95-LS2.8-TL
  rect 1.1x0.6 smd: 1(-1.3,0.95) 2(-1.3,0) 3(-1.3,-0.95) 4(1.3,-0.95) 5(1.3,0.95)

## Nets
As in the schematic.

Pads without a net: H4 4

## Routing (per net, layer and track width the routed paths; a pad name or vN(x,y) marks a point on that pad's centre or on a via; arc(x,y) is an arc through that point)
GND: length 96.3
  Top Layer w0.7: U1.5 18.94,70.45 C3.1 30.27,70.45 32.64,68.07 35.94,68.07 38.43,70.56 R18.1 40.17,74.51 47.56,67.12 51.37,67.12 H3.3 ; C4.2 6.18,79.34 1.4,74.55 1.4,53.72 5.68,49.44 11.52,49.44 R3.2
VCC: length 184.5
  Top Layer w0.7: U1.7 16.13,73.53 19.43,76.84 51.18,76.84 ; 51.18,76.84 56.01,76.84 60.71,72.14 60.71,53.21 59.34,51.85 ; 51.18,76.84 53.85,74.17 53.85,64.52 H3.1 ; 59.34,51.85 47.54,40.05 U3.5 32.51,39.09 32.51,36.83 31.37,35.69 17.53,35.69 15.88,34.04 15.88,31.24 17.4,29.72 U2.4 ; 59.34,51.85 40.1,51.85 38.12,53.83 38.12,56.02 U4.5
VEE: length 205.2
  Top Layer w0.7: 49.53,62.74 49.53,58.93 47.8,57.19 41.4,57.19 ; 49.53,62.74 H3.2 ; 49.53,62.74 48.51,61.72 32.77,61.72 32.64,61.85 ; 24.64,44.32 23.24,45.72 23.24,55.12 29.85,61.72 32.51,61.72 32.64,61.85 ; 24.64,44.32 29.22,44.32 30.56,42.99 30.56,42.25 ; 24.64,44.32 11.3,44.32 3.81,36.83 3.81,6.22 8.51,1.52 35.43,1.52 38.73,4.83 38.73,13.34 43.31,17.91 43.31,27.69 41.28,29.72 U2.11 ; 32.64,61.85 29.21,65.28 18.77,65.28 U1.4
A: length 94.1
  Top Layer w0.7: U1.2 16.13,63.38 R3.1
  Bottom Layer w0.7: H4.1 62.17,67.25 62.17,77.28 59.31,80.14 39.62,80.14 36.01,76.52 36.01,71.36 35.88,71.23 35.88,70.87 34.1,69.09 29.02,69.09 22.29,75.82 15.75,75.82 14.35,74.42 R3.1
B: length 70.3
  Top Layer w0.7: R4.2 18.79,61.73 17.4,63.12 17.4,65.17
  Bottom Layer w0.7: H4.2 60.1,67.72 60.1,76.43 58.04,78.49 42.16,78.49 40.04,76.36 40.04,72.66 34.83,67.45 22.24,67.45 20.57,65.79 R4.2
HP150M: length 81.6
  Top Layer w0.7: U2.2 U2.1 30.37,33.53 R8.2
  Bottom Layer w0.7: C9.1 17.35,1.68 6.06,1.68 3.18,4.57 3.18,16.64 12.32,25.78 22.35,25.78 25.02,28.45 25.02,31.5 22.98,33.53 R8.2
INA+: length 111.7
  Top Layer w0.254: 30.37,30.99 U2.3
  Top Layer w0.7: R5.2 30.37,30.99
  Bottom Layer w0.7: R5.2 22.49,30.99 18.27,26.78 5.6,26.78 1.4,30.99 1.4,74.55 3.94,77.09 23.24,77.09 29.32,71.01 C5.2
INAMP: length 18.1
  Top Layer w0.7: 17.4,70.72 17.4,72.14 18.78,73.51 C5.1
INB-: length 18.1
  Top Layer w0.7: U2.6 30.37,27.18 R9.2 27.56,23.75 22.35,18.54 R8.1
INC-: length 53.6
  Top Layer w0.7: U2.9 40.39,27.18 R11.1 ; R10.1 10.41,3.89 C1.1
  Bottom Layer w0.7: R10.1 22.23,12.19 30.1,20.07 39.24,20.07 41.15,21.97 R11.1
IND+: length 72.9
  Top Layer w0.7: C9.2 24.22,4.66 25.53,5.97 33.4,5.97 36.07,8.64 R12.1 ; U2.12 45.47,30.99 R20.1
  Bottom Layer w0.7: R12.1 41.78,3.43 50.17,3.43 52.96,6.22 52.96,16.38 45.97,23.37 R20.1
IND-: length 20.4
  Top Layer w0.7: R15.1 50.93,29.59 46.87,33.65 R13.1 41.66,32.26 U2.13
INOPA-: length 44.8
  Top Layer w0.7: U3.4 29.66,37.53 R21.1
  Bottom Layer w0.7: R21.1 19.56,37.47 11.81,29.72 6.48,29.72 4.32,31.88 4.32,44.59
LP160: length 89.1
  Top Layer w0.7: R22.1 31.56,45.9 U3.1
  Bottom Layer w0.7: R22.1 34.8,49.14 34.8,59.69 42.8,67.69 42.8,71.25 ; 42.8,71.25 37.47,65.91 25.65,65.91 22.61,62.87 22.61,57.28 18.96,53.63 15.15,53.63 7.73,46.22 C6.2 ; 42.8,71.25 42.8,74.31 R19.1
NOTCH60: length 52.5
  Top Layer w0.7: R16.2 37.34,34.95 U2.14 ; R11.2 R15.2 57.4,17.9 R25.2
  Bottom Layer w0.7: R11.2 43.18,13.46 43.18,26.8 37.34,32.64 R16.2
OFFSET: length 27.5
  Top Layer w0.7: H4.3 56.97,67.51 55.12,65.66 55.12,58.67 51,54.56 R17.2 40.94,54.58 U4.1
OUTB: length 17
  Top Layer w0.7: R10.2 27.55,12.19 R9.1 30.38,15 U2.7
OUTC: length 39.2
  Top Layer w0.7: C1.2 15.07,4.02 18.54,7.49 32.39,7.49 36.07,11.18 R12.2 36.07,25.76 U2.8
V_2+: length 6.1
  Bottom Layer w0.7: R14.1 51.76,70.44 H3.4
$1N2958: length 126.4
  Top Layer w0.7: C7.1 44.59,7.63 46.48,9.53 53.59,9.53 R25.1
  Bottom Layer w0.7: R24.1 28.96,59.57 28.96,43.41 25.93,40.39 ; 25.93,40.39 17.65,40.39 14.73,37.47 R21.2 12.69,35.43 7.78,35.43 C8.1 ; 25.93,40.39 30.1,40.39 37.34,47.62 R16.1 37.59,50.93 39.88,48.64 39.88,32.77 44.45,28.19 44.45,6.11 C7.1
$1N3420: length 21
  Top Layer w0.7: U4.4 38.34,59.42 R18.2
  Bottom Layer w0.7: R17.1 43.37,54.56 R18.2
$1N3441: length 7.3
  Top Layer w0.7: R14.2 R19.2 42.3,59.51 U4.3
$1N10128: length 6
  Top Layer w0.7: R1.1 11.7,68.33 U1.1
$1N10133: length 6.9
  Top Layer w0.7: R2.2 10.16,54.1 R1.2
$1N10138: length 10.1
  Top Layer w0.7: R2.1 10.03,73.41 12.58,70.87 14.71,70.87 U1.8
$1N10195: length 19.7
  Top Layer w0.7: R5.1 16,16 R6.2 10.41,18.54 7.62,15.75 R7.2
$1N10257: length 28.2
  Top Layer w0.7: R23.1 57.4,26.92 R20.2
$1N10286: length 28.2
  Bottom Layer w0.7: R22.2 32.77,64.9 27.3,64.9 23.88,61.47 23.88,49.65 R24.2

## Copper pours and planes (outline as drawn; the poured copper is in the pictures)
GND on Top Layer: 0.51,51.56 62.99,51.56 62.99,0.25 0.51,0.25
GND on Top Layer: 0.26,51.56 63.25,51.56 63.25,0 0.26,0
GND on Top Layer: -0.13,50.71 63.25,50.71 63.25,0 -0.13,0
GND on Top Layer: 13.84,80.9 62.86,80.9 62.86,61.59 13.84,61.59

# Board PCB1
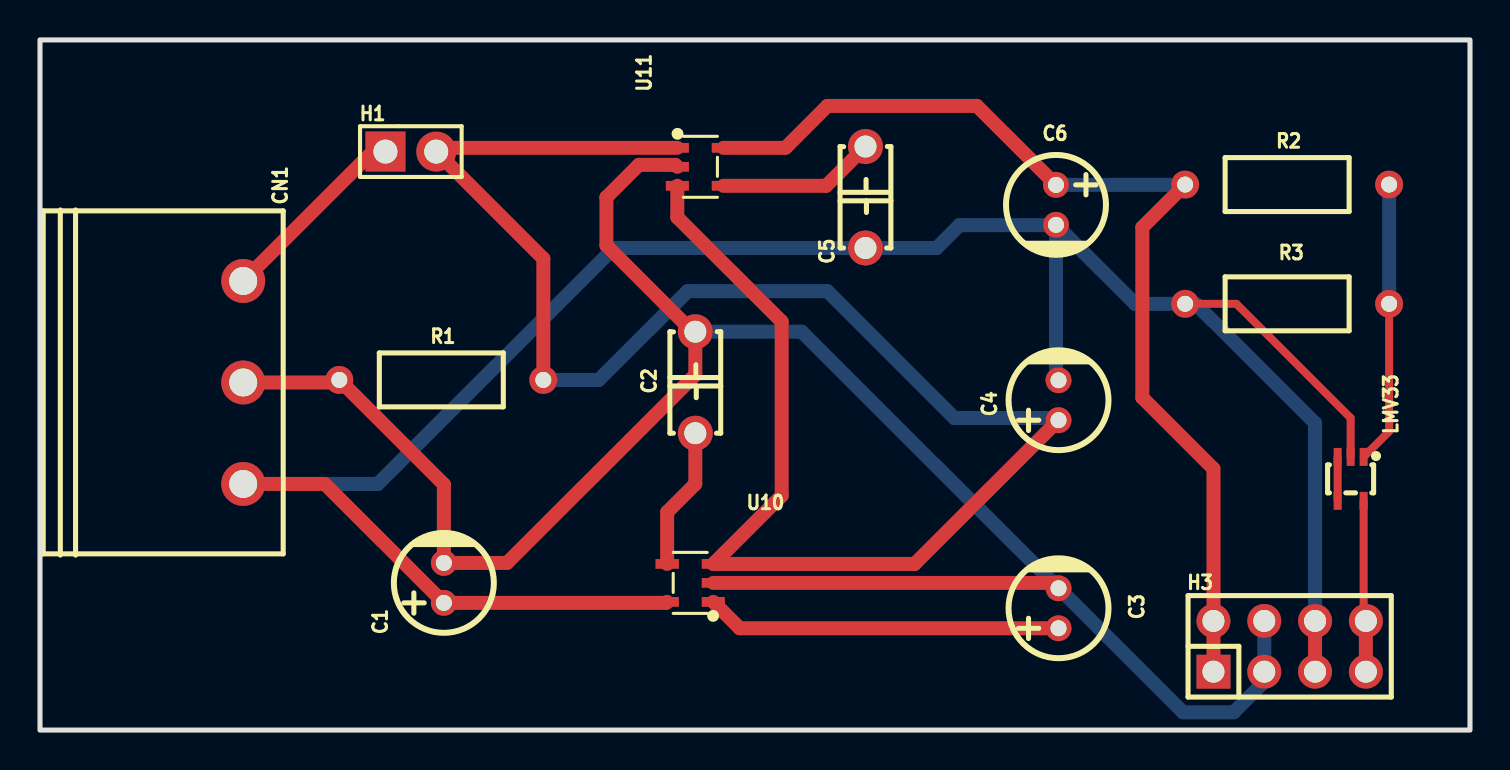
[diagram p4: board, top side]
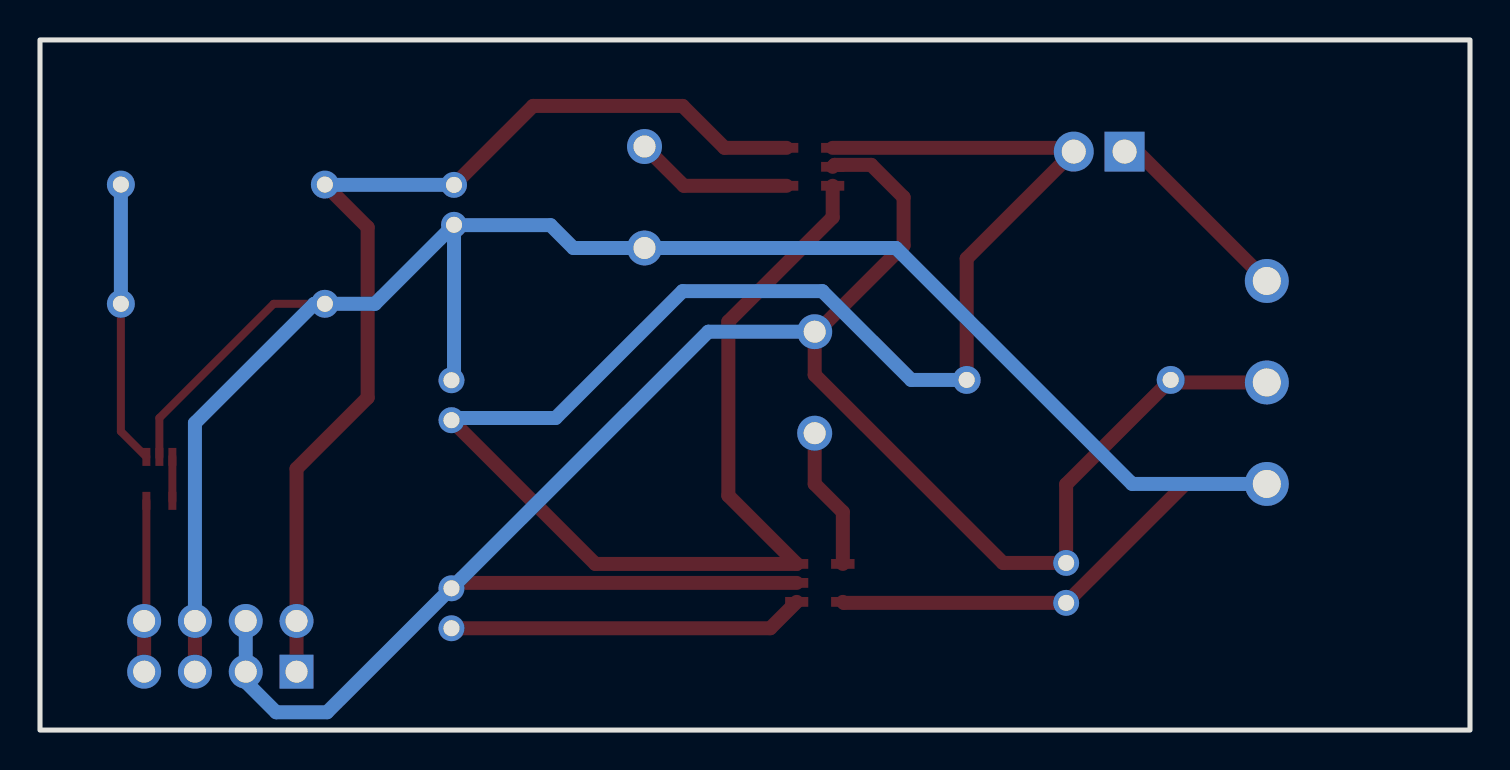
[diagram p5: board, bottom side, seen from below]

Outline 71.5 x 34.54 mm; copper layers: Top Layer, Bottom Layer. Coordinates in mm from the lower left corner of the outline.
Outline path: rectangle 0,34.54 71.5,0
Stack: Top Layer 0.035mm / Dielectric1 1.51mm FR4 er 4.5 / Bottom Layer 0.035mm

## Design rules (mm)
template: Custom Config
spacing copperThickness1oz (default): track to track 0.152, other pairs 0.152 to 0.3
spacing copperThickness2oz: track to track 0.203, other pairs 0.152 to 0.3
track width copperThickness1oz (default): min 0.127, default 0.7, max 2.54
track width copperThickness2oz: min 0.203, default 0.254, max 2.54
differential pair differentialPair (default): width min 0.127, default 0.254, max 2.54; gap min 0.152, default 0.152
via viaSize (default): diameter min 0.5, default 0.61, max 10; hole min 0.3, default 0.305, max 6.3

## Placement (name value [footprint] x y rotation side)
C1  100uF  [CAP-TH_BD5.0-P2.00-D0.8-FD]  20.19 7.37 90 top
C2  22nF  [CAP-TH_L4.8-W2.3-P5.08-D0.65]  32.77 17.4 90 top
C3  10uF  [CAP-TH_BD5.0-P2.00-D0.8-FD]  50.93 6.1 90 top
C4  10uF  [CAP-TH_BD5.0-P2.00-D0.8-FD]  50.93 16.51 90 top
C5  22nF  [CAP-TH_L4.8-W2.3-P5.08-D0.65]  41.28 26.67 90 top
C6  100uF  [CAP-TH_BD5.0-P2.00-D0.8-FD]  50.8 26.29 270 top
CN1  1757255  [CONN-TH_3P-P5.08_1757255]  10.16 17.4 270 top
H1  PZ254V-11-02P  [HDR-TH_2P-P2.54-V-M]  18.54 28.96 0 top
H3  PZ254V-12-8P  [HDR-TH_8P-P2.54-V-M-R2-C4-S2.54]  62.48 4.19 0 top
LMV33  LMV331M7X/NOPB  [SC-70-5_L2.1-W1.3-P0.65-LS2.1-BR]  65.53 12.57 90 top
R1  100kΩ  [RES-TH_BD2.7-L6.2-P10.20-D0.4]  20.07 17.53 0 top
R2  10kΩ  [RES-TH_BD2.7-L6.2-P10.20-D0.4]  62.36 27.3 0 top
R3  10kΩ  [RES-TH_BD2.7-L6.2-P10.20-D0.4]  62.36 21.34 180 top
U10  RT9193-33GB  [SOT-23-5_L3.0-W1.7-P0.95-LS2.8-BL]  32.51 7.37 90 top
U11  RT9193-33GB  [SOT-23-5_L3.0-W1.7-P0.95-LS2.8-BL]  33.02 28.19 270 top

## Footprints (pads in the part's own frame, mm; a bottom-side part is the same pattern mirrored in y, then rotated)
CAP-TH_BD5.0-P2.00-D0.8-FD
  round 1.3 hole 0.8: 1(-1,0) 2(1,0)
CAP-TH_L4.8-W2.3-P5.08-D0.65
  round 1.75 hole 1.1: 1(-2.54,0) 2(2.54,0)
CONN-TH_3P-P5.08_1757255
  round 2.2 hole 1.4: 1(-5.08,0) 2(0,0) 3(5.08,0)
HDR-TH_2P-P2.54-V-M
  rect 2x2 hole 1.2: 1(-1.27,0)
  round 2 hole 1.2: 2(1.27,0)
HDR-TH_8P-P2.54-V-M-R2-C4-S2.54
  rect 1.7x1.7 hole 1.1: 1(-3.81,-1.27)
  round 1.7 hole 1.1: 2(-3.81,1.27) 3(-1.27,-1.27) 4(-1.27,1.27) 5(1.27,-1.27) 6(1.27,1.27) 7(3.81,-1.27) 8(3.81,1.27)
RES-TH_BD2.7-L6.2-P10.20-D0.4
  round 1.4 hole 0.8: 1(-5.1,0) 2(5.1,0)
SC-70-5_L2.1-W1.3-P0.65-LS2.1-BR
  rect 0.9x0.4 smd: 1(1.1,-0.65) 2(1.1,0) 3(1.1,0.65) 4(-1.1,0.65) 5(-1.1,-0.65)
SOT-23-5_L3.0-W1.7-P0.95-LS2.8-BL
  rect 0.49x1.157 smd: 1(-0.95,-1.153) 2(0,-1.153) 3(0.95,-1.153)
  rect 0.49x1.175 smd: 4(0.95,1.153) 5(-0.95,1.153)

## Nets
VCC: CN1.1 H1.1
EN_9V: C4.1 H1.2 R1.2 U10.3 U11.1 U11.3
GND/V-: C1.2 C2.2 C3.2 CN1.2 H3.3 H3.4 R1.1 U10.2 U11.2
V+: C6.1 H3.1 H3.2 R2.1 U11.5
V_2+: H3.7 H3.8 LMV33.5
VT_GND: C1.1 C4.2 C5.1 C6.2 CN1.3 H3.5 H3.6 LMV33.2 R3.2 U10.5
$1N512: LMV33.1 R2.2 R3.1
$1N952: C5.2 U11.4
$1N1501: C3.1 U10.1
$1N1513: C2.1 U10.4
$1N1779: LMV33.3 LMV33.4

## Routing (per net, layer and track width the routed paths; a pad name or vN(x,y) marks a point on that pad's centre or on a via; arc(x,y) is an arc through that point)
VCC: length 9.8
  Top Layer w0.7: H1.1 16.64,28.96 CN1.1
EN_9V: length 98.8
  Top Layer w0.7: 31.87,29.14 20,29.14 H1.2 25.17,23.6 R1.2 ; C4.1 43.73,8.32 U10.3 37.08,11.73 37.08,20.45 31.87,25.66 U11.3
  Bottom Layer w0.7: R1.2 27.94,17.53 32.38,21.97 39.37,21.97 45.72,15.62 50.82,15.62 C4.1
GND/V-: length 105.1
  Top Layer w0.7: CN1.2 14.84,17.4 R1.1 20.19,12.3 C1.2 23.35,8.37 32.77,17.78 C2.2 32.64,19.94 28.32,24.26 28.32,26.67 29.94,28.29 31.77,28.29 U11.2 ; U10.2 50.66,7.37 C3.2
  Bottom Layer w0.7: H3.4 H3.3 61.21,2.41 59.69,0.89 57.15,0.89 50.94,7.1 C3.2 38.08,19.94 C2.2
V+: length 52.3
  Top Layer w0.7: R2.1 55.12,25.17 55.12,16.64 58.67,13.08 H3.2 H3.1 ; C6.1 46.85,31.24 39.37,31.24 37.27,29.14 34.17,29.14
  Bottom Layer w0.7: R2.1 57.24,27.29 C6.1
V_2+: length 8.6
  Top Layer w0.4: H3.8 66.18,5.57 LMV33.5
  Top Layer w0.7: H3.7 H3.8
VT_GND: length 119.6
  Top Layer w0.4: LMV33.2 65.53,15.62 59.82,21.34 R3.2
  Top Layer w0.7: U10.5 31.31,6.37 C1.1 14.24,12.32 CN1.3 ; H3.5 H3.6
  Bottom Layer w0.7: C4.2 50.8,17.64 C6.2 ; C6.2 50.78,25.27 45.97,25.27 44.83,24.13 C5.1 28.7,24.13 16.89,12.32 CN1.3 ; C6.2 54.75,21.34 R3.2 57.78,21.34 63.75,15.37 H3.6
$1N512: length 14.2
  Top Layer w0.4: LMV33.1 67.46,14.95 R3.1
  Bottom Layer w0.7: R2.2 R3.1
$1N952: length 7.9
  Top Layer w0.7: C5.2 39.31,27.24 U11.4
$1N1501: length 17.8
  Top Layer w0.7: U10.1 34.99,5.1 C3.1
$1N1513: length 7.1
  Top Layer w0.7: C2.1 32.77,12.32 31.36,10.91 U10.4
$1N1779: length 2.2
  Top Layer w0.4: LMV33.3 LMV33.4
